# EAGLE design controller_board (EAGLE 7.6.0)
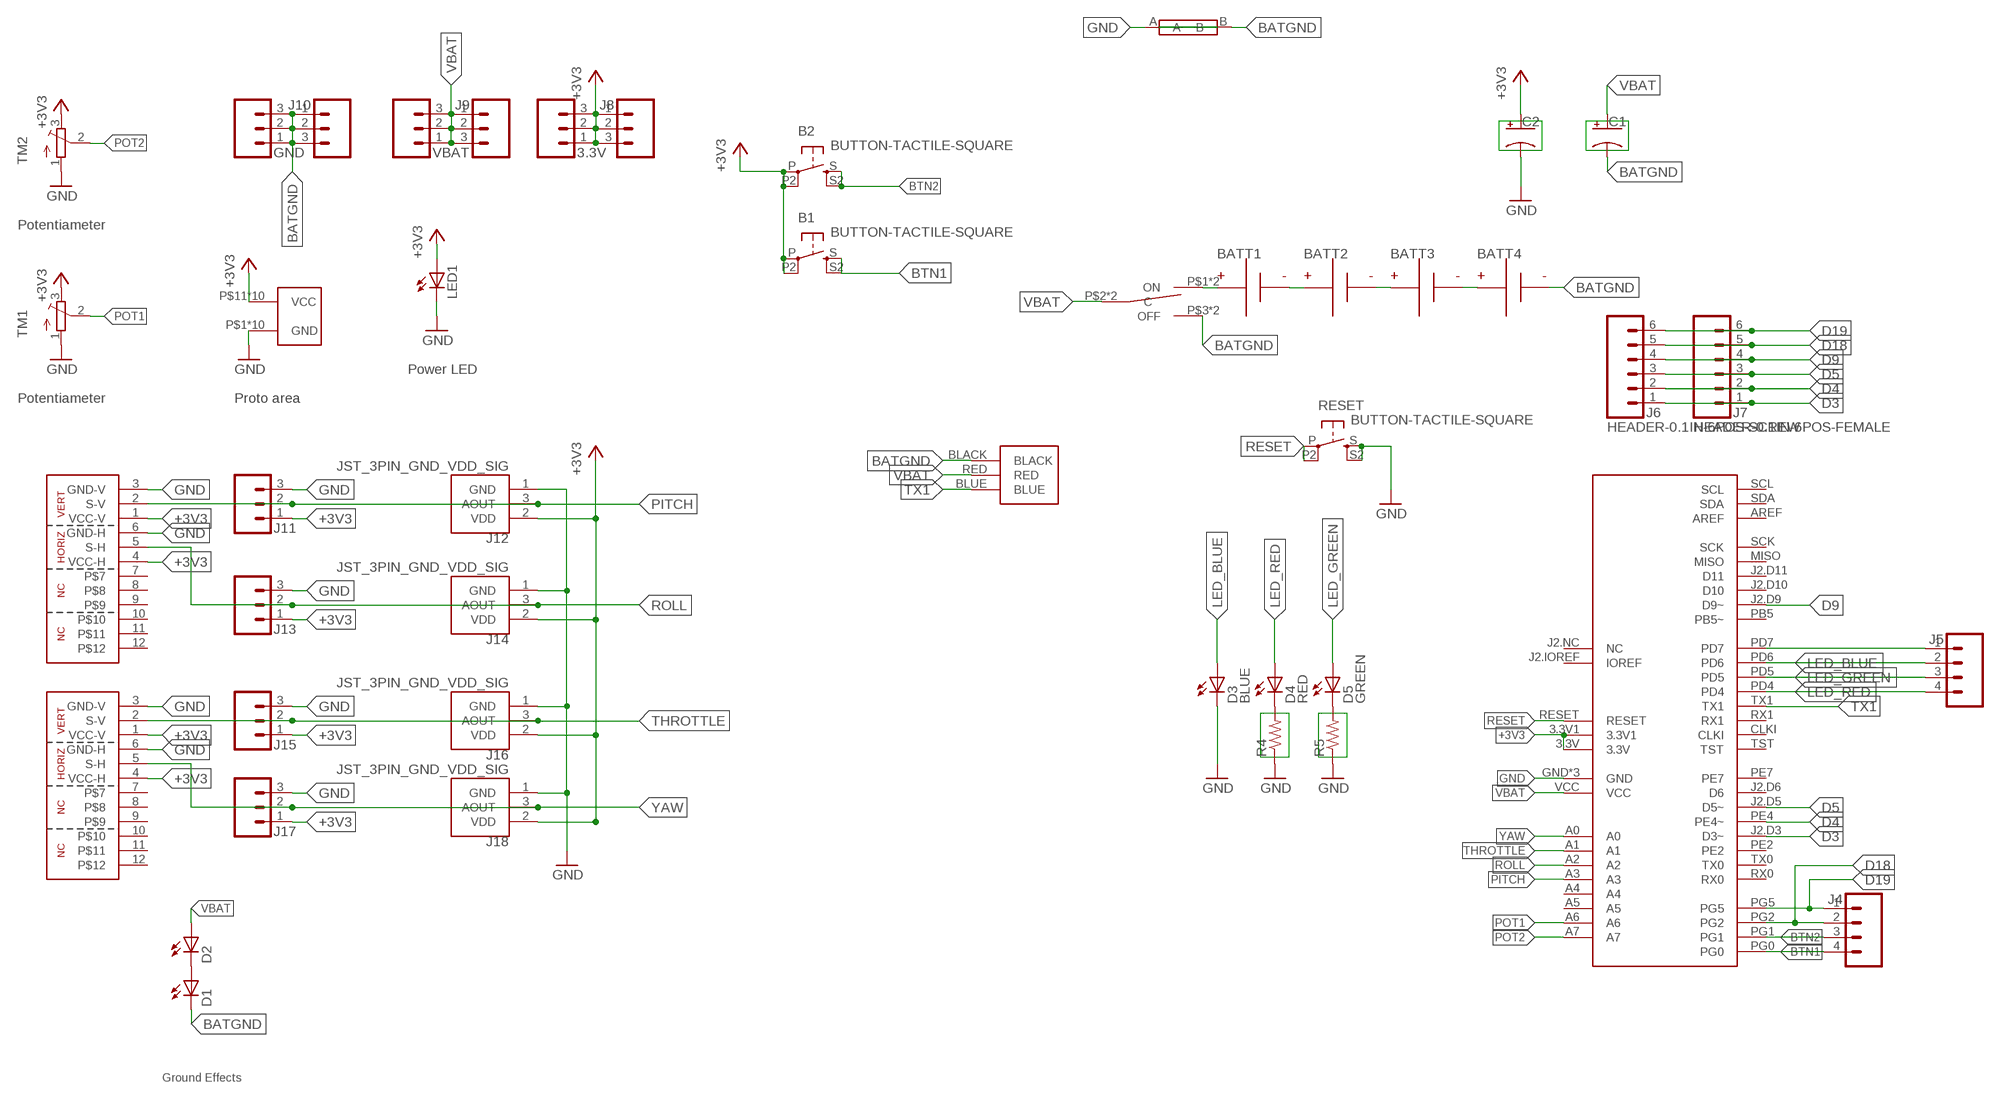
[diagram p0: schematic, sheet 1]

## Parts
3.3V  HEADER-0.1IN-3POS-SCREW  [SCREW-TERMINAL-1X3-2.54MM]
B1  BUTTON-TACTILE-SQUARE  [BUTTON-TACTILE-SQUARE-ADAFRUIT1010]
B2  BUTTON-TACTILE-SQUARE  [BUTTON-TACTILE-SQUARE-ADAFRUIT1010]
BATT1  BATTERY-AA-CLIP  [BATTERY-AA-BK-92]
BATT2  BATTERY-AA-CLIP  [BATTERY-AA-BK-92]
BATT3  BATTERY-AA-CLIP  [BATTERY-AA-BK-92]
BATT4  BATTERY-AA-CLIP  [BATTERY-AA-BK-92]
C1  RESOLVED-CAPACITOR-POL_TH-RADIAL_ALUMINUM_18MM  [CAPPRD750W80D1800H2200P]
C2  RESOLVED-CAPACITOR-POL_TH-RADIAL_ALUMINUM_6.3MM  [CAPPRD250W80D630H1220P]
D1  LED3MM  [LED3MM]
D2  LED3MM  [LED3MM]
D3  BLUE  LED3MM  [LED3MM]
D4  RED  LED3MM  [LED3MM]
D5  GREEN  LED3MM  [LED3MM]
F1  SHORT  [SHORT]
GND  HEADER-0.1IN-3POS-SCREW  [SCREW-TERMINAL-1X3-2.54MM]
J1  FRSKY-GIMBAL  [JST-13-PTH]
J2  FRSKY-GIMBAL  [JST-13-PTH]
J3  WIRE-HARNESS-SPARKFUN-9915  [WIRE-HARNESS-SPARKFUN-9915]
J4  HEADER-0.1IN-4POS-FEMALE  [HDRV4W63P254_4X1_1016X254H838_HS]
J5  HEADER-0.1IN-4POS-FEMALE  [HDRV4W63P254_4X1_1016X254H838_HS]
J6  HEADER-0.1IN-6POS-SCREW  [SCREW-TERMINAL-1X6-2.54MM]
J7  HEADER-0.1IN-6POS-FEMALE  [HDRV6W63P254_6X1_1524X254H838_HS]
J8  HEADER-0.1IN-3POS-FEMALE  [HDRV3W63P254_3X1_762X254H838_HS]
J9  HEADER-0.1IN-3POS-FEMALE  [HDRV3W63P254_3X1_762X254H838_HS]
J10  HEADER-0.1IN-3POS-FEMALE  [HDRV3W63P254_3X1_762X254H838_HS]
J11  HEADER-0.1IN-3POS-SCREW  [SCREW-TERMINAL-1X3-2.54MM]
J12  JST_3PIN_GND_VDD_SIG  [JST-3-PTH-REVERSE]
J13  HEADER-0.1IN-3POS-SCREW  [SCREW-TERMINAL-1X3-2.54MM]
J14  JST_3PIN_GND_VDD_SIG  [JST-3-PTH-REVERSE]
J15  HEADER-0.1IN-3POS-SCREW  [SCREW-TERMINAL-1X3-2.54MM]
J16  JST_3PIN_GND_VDD_SIG  [JST-3-PTH-REVERSE]
J17  HEADER-0.1IN-3POS-SCREW  [SCREW-TERMINAL-1X3-2.54MM]
J18  JST_3PIN_GND_VDD_SIG  [JST-3-PTH-REVERSE]
LED1  LED-5MM-RED  [LED5MM]
R4  RESOLVED-RESISTOR_TH-1/6W-CARBON  [RESAD770W45L370D210_HS]
R5  RESOLVED-RESISTOR_TH-1/6W-CARBON  [RESAD770W45L370D210_HS]
RESET  BUTTON-TACTILE-SQUARE  [BUTTON-TACTILE-SQUARE-ADAFRUIT1010]
S1  POWER-SWITCH-MFS201N-9-Z  [POWER-SWITCH-MFS201N-9-Z]
TM1  TRIMPOT3386  [TRIM-3386]
TM2  TRIMPOT3386  [TRIM-3386]
U$3  PROTO-AREA-10X10  [PROTO-AREA-10X10]
U$4  ATMEGA128RFA1-BOB  [ATMEGA128RFA1]
VBAT  HEADER-0.1IN-3POS-SCREW  [SCREW-TERMINAL-1X3-2.54MM]

## Nets
+3V3: 3.3V.1 3.3V.2 3.3V.3 B1.P B1.P2(P1) B2.P B2.P2(P1) C2.1(+) J1.1(VCC-V) J1.4(VCC-H) J2.1(VCC-V) J2.4(VCC-H) J8.1 J8.2 J8.3 J11.1 J12.2(VDD) J13.1 J14.2(VDD) J15.1 J16.2(VDD) J17.1 J18.2(VDD) LED1.A TM1.3(E) TM2.3(E) U$3.P$11(VCC) U$3.P$12(VCC) U$3.P$13(VCC) U$3.P$14(VCC) U$3.P$15(VCC) U$3.P$16(VCC) U$3.P$17(VCC) U$3.P$18(VCC) U$3.P$19(VCC) U$3.P$20(VCC) U$4.3.3V U$4.3.3V1
BATGND [HIGH-I]: BATT4.N1(N) BATT4.N2(N) C1.2(-) D1.K(C) F1.B GND.1 GND.3 J3.BLACK J10.1 J10.2 J10.3 S1.P$3(OFF) S1.P$6(OFF)
BTN1: B1.S B1.S2(S1) J4.4 U$4.PG0
BTN2: B2.S B2.S2(S1) J4.3 U$4.PG1
D3: J6.1 J7.1 U$4.J2.D3(D3~)
D4: J6.2 J7.2 U$4.PE4(PE4~)
D5: J6.3 J7.3 U$4.J2.D5(D5~)
D9: J6.4 J7.4 U$4.J2.D9(D9~)
D18: J4.2 J6.5 J7.5 U$4.PG2
D19: J4.1 J6.6 J7.6 U$4.PG5
GND: C2.2(-) D3.K(C) F1.A J1.3(GND-V) J1.6(GND-H) J2.3(GND-V) J2.6(GND-H) J11.3 J12.1(GND) J13.3 J14.1(GND) J15.3 J16.1(GND) J17.3 J18.1(GND) LED1.K(C) R4.1 R5.1 RESET.S RESET.S2(S1) TM1.1(A) TM2.1(A) U$3.P$1(GND) U$3.P$2(GND) U$3.P$3(GND) U$3.P$4(GND) U$3.P$5(GND) U$3.P$6(GND) U$3.P$7(GND) U$3.P$8(GND) U$3.P$9(GND) U$3.P$10(GND) U$4.GND U$4.GND1(GND) U$4.GND2(GND)
LED_BLUE: D3.A J5.2 U$4.PD6
LED_GREEN: D5.A J5.3 U$4.PD5
LED_RED: D4.A J5.4 U$4.PD4
N$1 [HIGH-I]: BATT1.N1(N) BATT1.N2(N) BATT2.P1(P) BATT2.P2(P)
N$2 [HIGH-I]: BATT2.N1(N) BATT2.N2(N) BATT3.P1(P) BATT3.P2(P)
N$3 [HIGH-I]: BATT3.N1(N) BATT3.N2(N) BATT4.P1(P) BATT4.P2(P)
N$4: D4.K(C) R4.2
N$5 [HIGH-I]: BATT1.P1(P) BATT1.P2(P) S1.P$1(ON) S1.P$4(ON)
N$6: D5.K(C) R5.2
N$9: J5.1 U$4.PD7
N$13: D1.A D2.K(C)
PITCH: J1.2(S-V) J11.2 J12.3(AOUT) U$4.A3
POT1: TM1.2(S) U$4.A6
POT2: TM2.2(S) U$4.A7
RESET: RESET.P RESET.P2(P1) U$4.RESET
ROLL: J1.5(S-H) J13.2 J14.3(AOUT) U$4.A2
THROTTLE: J2.2(S-V) J15.2 J16.3(AOUT) U$4.A1
TX1: J3.BLUE U$4.TX1
VBAT [HIGH-I]: C1.1(+) D2.A J3.RED J9.1 J9.2 J9.3 S1.P$2(C) S1.P$5(C) U$4.VCC VBAT.1 VBAT.2 VBAT.3
YAW: J2.5(S-H) J17.2 J18.3(AOUT) U$4.A0
Unconnected: GND.2 J1.7 J1.8 J1.9 J1.10 J1.11 J1.12 J2.7 J2.8 J2.9 J2.10 J2.11 J2.12 U$4.A4 U$4.A5 U$4.AREF U$4.CLKI U$4.J2.D6(D6) U$4.J2.D10(D10) U$4.J2.D11(D11) U$4.J2.IOREF(IOREF) U$4.J2.NC(NC) U$4.MISO U$4.PB5(PB5~) U$4.PE2 U$4.PE7 U$4.RX0 U$4.RX1 U$4.SCK U$4.SCL U$4.SDA U$4.TST U$4.TX0

## Notes on the sheet
- Potentiameter
- Power LED
- Potentiameter | Proto area
- Ground Effects

## Library data of the parts
3.3V GND VBAT = Components:HEADER-0.1IN-3POS: 3 pin single inline pin header, socket, or connector; DIST: digikey; DISTPN: ED10562-ND
B1 B2 RESET = Controller:BUTTON-TACTILE; DIST: ADAFRUIT; DISTPN: 1010
BATT1-BATT4 = Components:BATTERY; DIST: Digikey; DISTPN: BK-92-ND; QTY: 2; ROUGH_HEIGHT: 16
C1 = KoalaBuild:RESOLVED-CAPACITOR-POL_: Polarized capacitor; DIST: Digikey; DISTPN: P5158-ND
C2 = KoalaBuild:RESOLVED-CAPACITOR-POL_: Polarized capacitor; DIST: Digikey; DISTPN: P5152-ND
D1-D3 = Components:LED: LED OSRAM: - CHIPLED LG R971, LG N971, LY N971, LG Q971, LY Q971, LO R971, LY R971 LH N974, LH R974 LS Q976, LO Q976, LY Q976 LO Q996 - Hyper CHIPLED LW Q18S LB Q993, LB Q99A, LB R99A - SideLED LS A670, LO A670, LY A670, LG A670, LP A670 LB A673, LV A673, LT A673, LW A673 LH A674 LY A675 LS A676, LA A676, LO A676, LY A676, LW A676 LS A679, LY A679, LG A679 - Hyper Micro SIDELED® LS Y876, LA Y876, LO Y876, LY Y876 LT Y87S - SmartLED LW L88C, LW L88S LB L89C, LB L89S, LG L890 LS L89K, LO L89K, LY L89K LS L896, LA L896, LO L896, LY L896 - TOPLED LS T670, LO T670, LY T670, LG T670, LP T670 LSG T670, LSP T670, LSY T670, LOP T670, LYG T670 LG T671, LOG T671, LSG T671 LB T673, LV T673, LT T673, LW T673 LH T674 LS T676, LA T676, LO T676, LY T676, LB T676, LH T676, LSB T676, LW T676 LB T67C, LV T67C, LT T67C, LS T67K, LO T67K, LY T67K, LW E67C LS E67B, LA E67B, LO E67B, LY E67B, LB E67C, LV E67C, LT E67C LW T67C LS T679, LY T679, LG T679 LS T770, LO T770, LY T770, LG T770, LP T770 LB T773, LV T773, LT T773, LW T773 LH T774 LS E675, LA E675, LY E675, LS T675 LS T776, LA T776, LO T776, LY T776, LB T776 LHGB T686 LT T68C, LB T68C - Hyper Mini TOPLED® LB M676 - Mini TOPLED Santana® LG M470 LS M47K, LO M47K, LY M47K Source: http://www.osram.convergy.de/; DIST: Adafruit; DISTPN: 780
D4 = Components:LED: LED OSRAM: - CHIPLED LG R971, LG N971, LY N971, LG Q971, LY Q971, LO R971, LY R971 LH N974, LH R974 LS Q976, LO Q976, LY Q976 LO Q996 - Hyper CHIPLED LW Q18S LB Q993, LB Q99A, LB R99A - SideLED LS A670, LO A670, LY A670, LG A670, LP A670 LB A673, LV A673, LT A673, LW A673 LH A674 LY A675 LS A676, LA A676, LO A676, LY A676, LW A676 LS A679, LY A679, LG A679 - Hyper Micro SIDELED® LS Y876, LA Y876, LO Y876, LY Y876 LT Y87S - SmartLED LW L88C, LW L88S LB L89C, LB L89S, LG L890 LS L89K, LO L89K, LY L89K LS L896, LA L896, LO L896, LY L896 - TOPLED LS T670, LO T670, LY T670, LG T670, LP T670 LSG T670, LSP T670, LSY T670, LOP T670, LYG T670 LG T671, LOG T671, LSG T671 LB T673, LV T673, LT T673, LW T673 LH T674 LS T676, LA T676, LO T676, LY T676, LB T676, LH T676, LSB T676, LW T676 LB T67C, LV T67C, LT T67C, LS T67K, LO T67K, LY T67K, LW E67C LS E67B, LA E67B, LO E67B, LY E67B, LB E67C, LV E67C, LT E67C LW T67C LS T679, LY T679, LG T679 LS T770, LO T770, LY T770, LG T770, LP T770 LB T773, LV T773, LT T773, LW T773 LH T774 LS E675, LA E675, LY E675, LS T675 LS T776, LA T776, LO T776, LY T776, LB T776 LHGB T686 LT T68C, LB T68C - Hyper Mini TOPLED® LB M676 - Mini TOPLED Santana® LG M470 LS M47K, LO M47K, LY M47K Source: http://www.osram.convergy.de/; DIST: Adafruit; DISTPN: 777
D5 = Components:LED: LED OSRAM: - CHIPLED LG R971, LG N971, LY N971, LG Q971, LY Q971, LO R971, LY R971 LH N974, LH R974 LS Q976, LO Q976, LY Q976 LO Q996 - Hyper CHIPLED LW Q18S LB Q993, LB Q99A, LB R99A - SideLED LS A670, LO A670, LY A670, LG A670, LP A670 LB A673, LV A673, LT A673, LW A673 LH A674 LY A675 LS A676, LA A676, LO A676, LY A676, LW A676 LS A679, LY A679, LG A679 - Hyper Micro SIDELED® LS Y876, LA Y876, LO Y876, LY Y876 LT Y87S - SmartLED LW L88C, LW L88S LB L89C, LB L89S, LG L890 LS L89K, LO L89K, LY L89K LS L896, LA L896, LO L896, LY L896 - TOPLED LS T670, LO T670, LY T670, LG T670, LP T670 LSG T670, LSP T670, LSY T670, LOP T670, LYG T670 LG T671, LOG T671, LSG T671 LB T673, LV T673, LT T673, LW T673 LH T674 LS T676, LA T676, LO T676, LY T676, LB T676, LH T676, LSB T676, LW T676 LB T67C, LV T67C, LT T67C, LS T67K, LO T67K, LY T67K, LW E67C LS E67B, LA E67B, LO E67B, LY E67B, LB E67C, LV E67C, LT E67C LW T67C LS T679, LY T679, LG T679 LS T770, LO T770, LY T770, LG T770, LP T770 LB T773, LV T773, LT T773, LW T773 LH T774 LS E675, LA E675, LY E675, LS T675 LS T776, LA T776, LO T776, LY T776, LB T776 LHGB T686 LT T68C, LB T68C - Hyper Mini TOPLED® LB M676 - Mini TOPLED Santana® LG M470 LS M47K, LO M47K, LY M47K Source: http://www.osram.convergy.de/; DIST: Adafruit; DISTPN: 779
F1 = RemotePartsB:SHORT
J1 = RemotePartsB:FRSKY-GIMBAL; CH1: PITCH; CH2: ROLL; DIST: Digikey; DISTPN: A100106-ND
J2 = RemotePartsB:FRSKY-GIMBAL; CH1: THR; CH2: YAW; DIST: Digikey; DISTPN: A100106-ND
J3 = RemotePartsB:WIRE-HARNESS-SPARKFUN-9915; DIST: Sparkfun; DISTPN: 9915
J4 J5 = Components:HEADER-0.1IN-4POS: 4 pin single inline pin header, socket, or connector; DIST: Digikey; DISTPN: S7002-ND
J6 = Components:HEADER-0.1IN-6POS: 6 pin single inline pin header, socket, or connector; DIST: Digikey; DISTPN: ED10565-ND; PIN1: D3; PIN2: D4; PIN3: D5; PIN4: D9; PIN5: D18; PIN6: D19
J7 = Components:HEADER-0.1IN-6POS: 6 pin single inline pin header, socket, or connector; DIST: MISSING; DISTPN: MISSING
J8-J10 = Components:HEADER-0.1IN-3POS: 3 pin single inline pin header, socket, or connector; DIST: Digikey; DISTPN: S7002-ND; PIN1: 1; PIN2: 2; PIN3: 3
J11 J13 J15 J17 = Components:HEADER-0.1IN-3POS: 3 pin single inline pin header, socket, or connector; DIST: digikey; DISTPN: ED10562-ND; PIN1: +; PIN2: A; PIN3: -
J12 J14 J16 J18 = RemotePartsB:JST_3PIN_GND_VDD_SIG; DIST: DIGIKEY; DISTPN: A100097-ND
LED1 = Components:LED: LED OSRAM: - CHIPLED LG R971, LG N971, LY N971, LG Q971, LY Q971, LO R971, LY R971 LH N974, LH R974 LS Q976, LO Q976, LY Q976 LO Q996 - Hyper CHIPLED LW Q18S LB Q993, LB Q99A, LB R99A - SideLED LS A670, LO A670, LY A670, LG A670, LP A670 LB A673, LV A673, LT A673, LW A673 LH A674 LY A675 LS A676, LA A676, LO A676, LY A676, LW A676 LS A679, LY A679, LG A679 - Hyper Micro SIDELED® LS Y876, LA Y876, LO Y876, LY Y876 LT Y87S - SmartLED LW L88C, LW L88S LB L89C, LB L89S, LG L890 LS L89K, LO L89K, LY L89K LS L896, LA L896, LO L896, LY L896 - TOPLED LS T670, LO T670, LY T670, LG T670, LP T670 LSG T670, LSP T670, LSY T670, LOP T670, LYG T670 LG T671, LOG T671, LSG T671 LB T673, LV T673, LT T673, LW T673 LH T674 LS T676, LA T676, LO T676, LY T676, LB T676, LH T676, LSB T676, LW T676 LB T67C, LV T67C, LT T67C, LS T67K, LO T67K, LY T67K, LW E67C LS E67B, LA E67B, LO E67B, LY E67B, LB E67C, LV E67C, LT E67C LW T67C LS T679, LY T679, LG T679 LS T770, LO T770, LY T770, LG T770, LP T770 LB T773, LV T773, LT T773, LW T773 LH T774 LS E675, LA E675, LY E675, LS T675 LS T776, LA T776, LO T776, LY T776, LB T776 LHGB T686 LT T68C, LB T68C - Hyper Mini TOPLED® LB M676 - Mini TOPLED Santana® LG M470 LS M47K, LO M47K, LY M47K Source: http://www.osram.convergy.de/; DIST: Adafruit; DISTPN: 679; ROUGH_HEIGHT: 13
R4 R5 = KoalaBuild:RESOLVED-RESISTOR_: Resistor; DIST: Digikey; DISTPN: 68EBK-ND
S1 = RemotePartsB:POWER-SWITCH-MFS201N-9-Z; DIST: Digikey; DISTPN: 563-1565-ND
TM1 TM2 = RemotePartsB:TRIMPOT: SMT trimmer potentiometer part number TC33X http://www.ladyada.net/library/eagle; DIST: Adafruit; DISTPN: 356
U$3 = Components:PROTO-AREA; DIST: Gadgetron; DISTPN: proto-area-10x10; ROUGH_HEIGHT: 15
U$4 = BOBs:ATMEGA128RFA1; DIST: Adafruit; DISTPN: 85

## Net classes
1 HIGH-I: width 1.5 mm

## Board
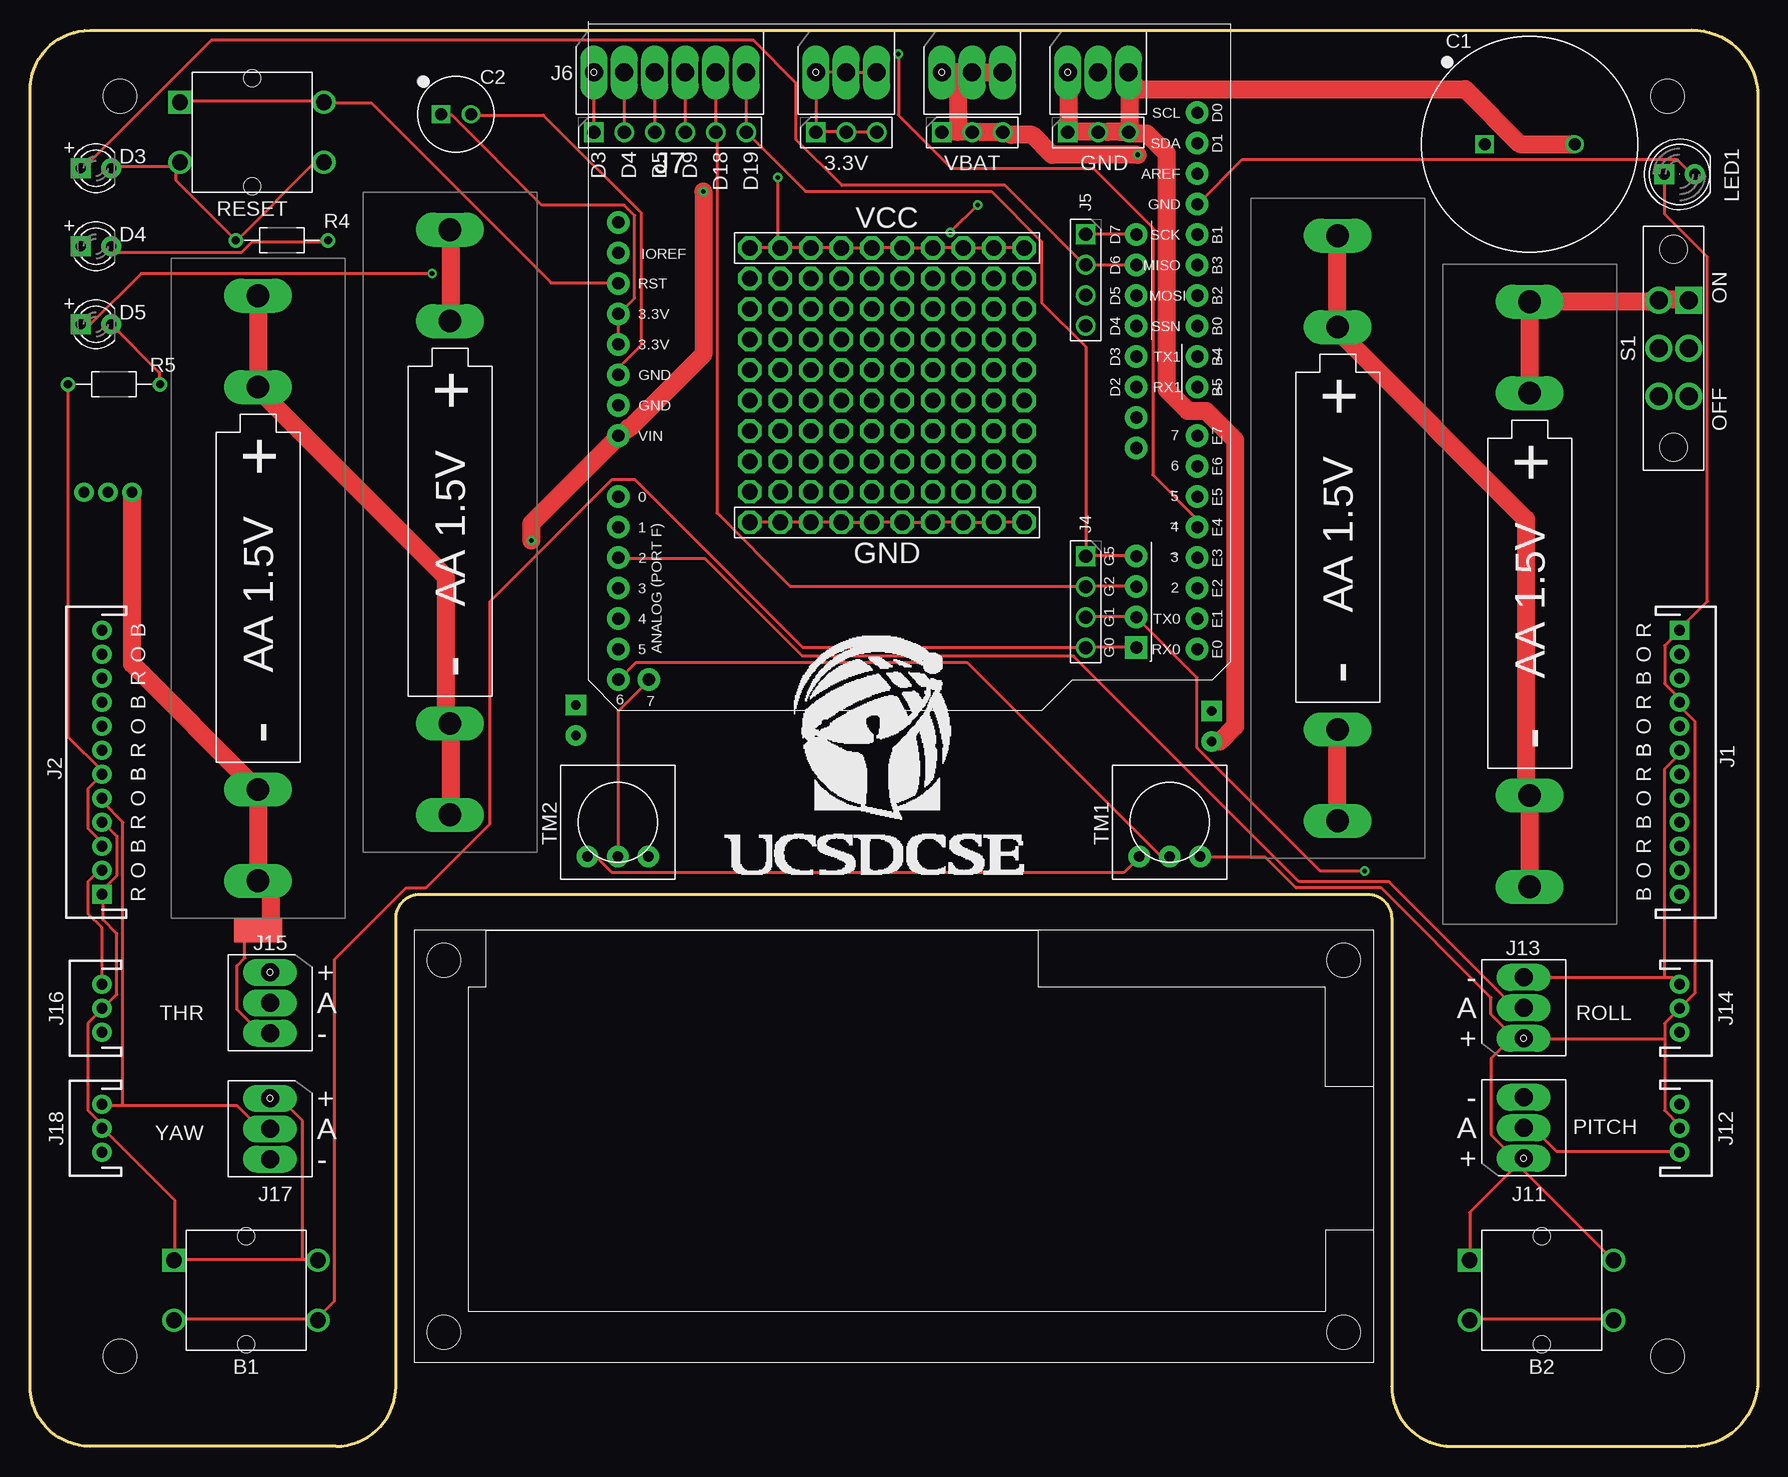
[diagram p1: board, top side]
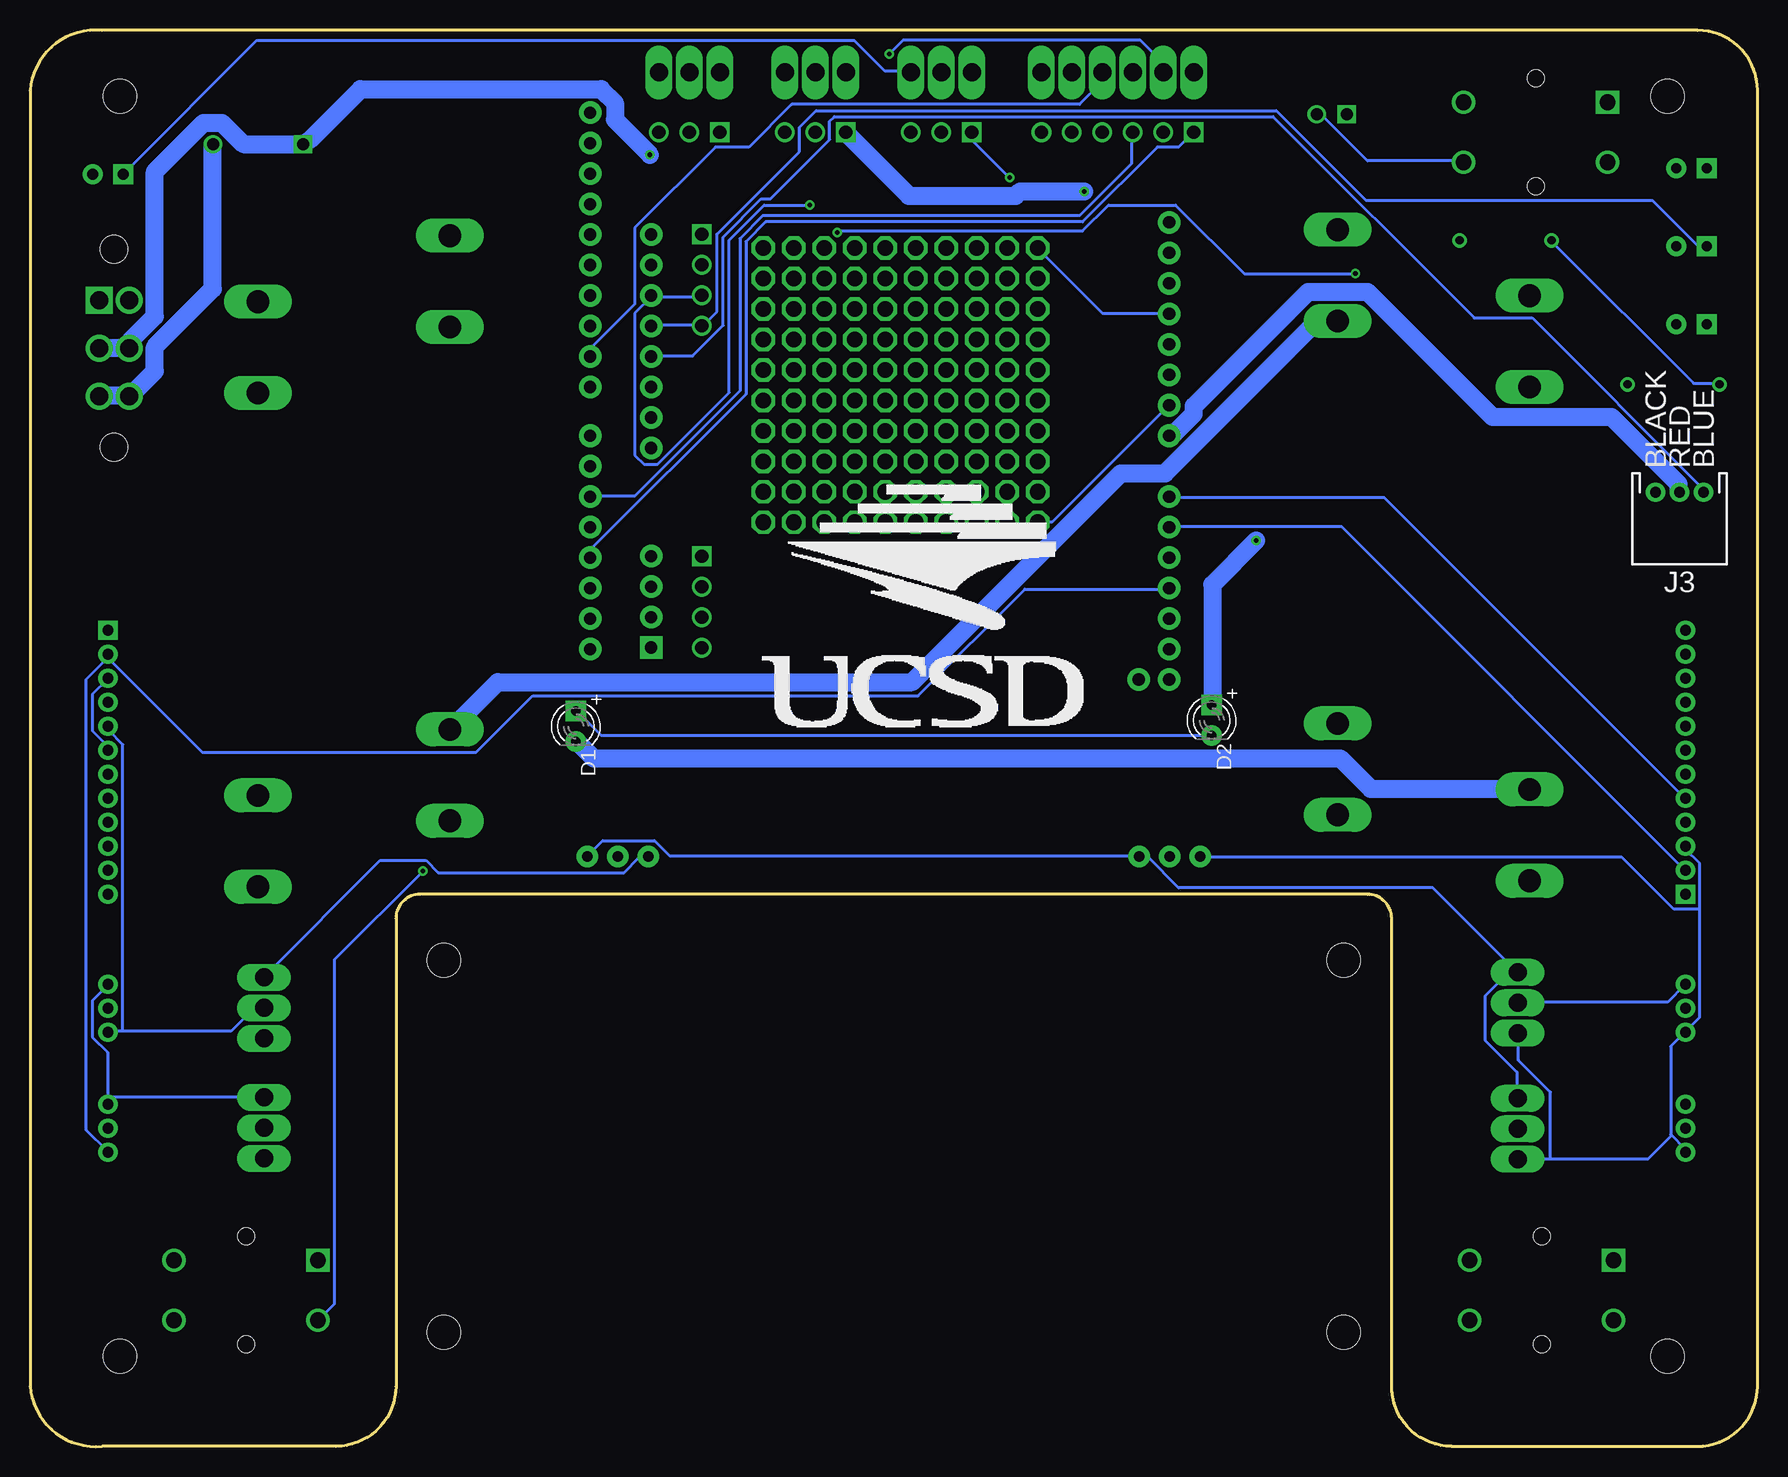
[diagram p2: board, bottom side, seen from below]

Size 144 x 118.05 mm. Coordinates in mm from the lower left corner, seen from the top.
Outline: 30.5,5.02 30.5,44.02 arc-90 32.5,46.02 111.5,46.02 arc-90 113.5,44.02 113.5,5.02 arc90 118.5,0.02 138,0.02 arc90 144,5.02 144,113.02 arc90 138,118.02 5,118.02 arc90 0,113.02 0,5.02 arc90 5,0.02 25.5,0.02 arc90 30.5,5.02
Copper layers (1*16): Top 0.035559375mm / dielectric 1.501140625mm / Bottom 0.035559375mm
Design rules "4pcb-33board *": minimum track width 10mil, minimum drill 15mil, track to track 10mil, track to pad 10mil, pad to pad 10mil, via to via 10mil, smd to smd 6mil, copper to edge 10mil, drill to drill 10mil, minimum pad ring 10mil, minimum via ring 8mil, stop-mask expansion 4mil, vias tented up to drill 0mil, thermal gap 10mil

### Footprints (pad centres in the part's own frame; a part is rotated, then mirrored left to right if it is on the bottom)
SCREW-TERMINAL-1X3-2.54MM = drill 1.5 pad 1.778 long: 1 0,0; 2 2.54,0; 3 5.08,0
BUTTON-TACTILE-SQUARE-ADAFRUIT1010 = drill 1.3 square: P -6,2.5 | drill 1.3: P2 6,2.5; S -6,-2.5; S2 6,-2.5 | hole 1.4: 0,4.5; 0,-4.5
BATTERY-AA-BK-92 = drill 1.9 long: N1 16.765,0; N2 24.385,0; P1 -24.385,0; P2 -16.765,0
CAPPRD750W80D1800H2200P = drill 1 pad 1.5 square: 1 -3.75,0 | drill 1 pad 1.5: 2 3.75,0
CAPPRD250W80D630H1220P = drill 1 pad 1.5 square: 1 -1.25,0 | drill 1 pad 1.5: 2 1.25,0
LED3MM = drill 0.813 pad 1.676 square: A -1.27,0 | drill 0.813 pad 1.676: K 1.27,0
SHORT = smd 2 x 2: A -1,0; B 1,0
JST-13-PTH = drill 0.9 pad 1.6 square: 1 -2,0 | drill 0.9 pad 1.6: 2 0,0; 3 2,0; 4 4,0; 5 6,0; 6 8,0; 7 10,0; 8 12,0; 9 14,0; 10 16,0; 11 18,0; 12 20,0
WIRE-HARNESS-SPARKFUN-9915 = drill 0.9 pad 1.6: BLACK 2,0; BLUE -2,0; RED 0,0
HDRV4W63P254_4X1_1016X254H838_HS = drill 1.1 pad 1.65 square: 1 0,0 | drill 1.1 pad 1.65: 2 2.54,0; 3 5.08,0; 4 7.62,0
SCREW-TERMINAL-1X6-2.54MM = drill 1.5 pad 1.778 long: 1 0,0; 2 2.54,0; 3 5.08,0; 4 7.62,0; 5 10.16,0; 6 12.7,0
HDRV6W63P254_6X1_1524X254H838_HS = drill 1.1 pad 1.65 square: 1 0,0 | drill 1.1 pad 1.65: 2 2.54,0; 3 5.08,0; 4 7.62,0; 5 10.16,0; 6 12.7,0
HDRV3W63P254_3X1_762X254H838_HS = drill 1.1 pad 1.65 square: 1 0,0 | drill 1.1 pad 1.65: 2 2.54,0; 3 5.08,0
JST-3-PTH-REVERSE = drill 0.9 pad 1.6: 1 -2,0; 2 0,0; 3 2,0
SPARKFUN_LCD_33 = hole 2.8: 77.5,2.5; 77.5,33.5; 2.5,2.5; 2.5,33.5
LED5MM = drill 0.9 pad 1.676 square: A -1.27,0 | drill 0.9 pad 1.676: K 1.27,0
CONTROLLER_OUTLINE = hole 2.8: -64.5,-52.5; 64.5,-52.5; 64.5,52.5; -64.5,52.5
RESAD770W45L370D210_HS = drill 0.7 pad 1.1: 1 -3.85,0; 2 3.85,0
POWER-SWITCH-MFS201N-9-Z = drill 1.5 square: P$1 -4,1.25 | drill 1.5: P$2 0,1.25; P$3 4,1.25; P$4 -4,-1.25; P$5 0,-1.25; P$6 4,-1.25 | hole 2.3: -8.25,0; 8.25,0
TRIM-3386 = drill 0.9 pad 1.778: 1 -2.54,-2.857; 2 0,-2.857; 3 2.54,-2.857
PROTO-AREA-10X10 = drill 1.3 octagon: P$1 0,0; P$2 2.54,0; P$3 5.08,0; P$4 7.62,0; P$5 10.16,0; P$6 12.7,0; P$7 15.24,0; P$8 17.78,0; P$9 20.32,0; P$10 22.86,0; P$11 0,22.86; P$12 2.54,22.86; P$13 5.08,22.86; P$14 7.62,22.86; P$15 10.16,22.86; P$16 12.7,22.86; P$17 15.24,22.86; P$18 17.78,22.86; P$19 20.32,22.86; P$20 22.86,22.86; P$21 0,2.54; P$22 2.54,2.54; P$23 5.08,2.54; P$24 7.62,2.54; P$25 10.16,2.54; P$26 12.7,2.54; P$27 15.24,2.54; P$28 17.78,2.54; P$29 20.32,2.54; P$30 22.86,2.54; P$31 22.86,5.08; P$32 20.32,5.08; P$33 17.78,5.08; P$34 15.24,5.08; P$35 12.7,5.08; P$36 10.16,5.08; P$37 7.62,5.08; P$38 5.08,5.08; P$39 2.54,5.08; P$40 0,5.08; P$41 0,7.62; P$42 2.54,7.62; P$43 5.08,7.62; P$44 7.62,7.62; P$45 10.16,7.62; P$46 12.7,7.62; P$47 15.24,7.62; P$48 17.78,7.62; P$49 20.32,7.62; P$50 22.86,7.62; P$51 22.86,10.16; P$52 20.32,10.16; P$53 17.78,10.16; P$54 15.24,10.16; P$55 12.7,10.16; P$56 10.16,10.16; P$57 7.62,10.16; P$58 5.08,10.16; P$59 2.54,10.16; P$60 0,10.16; P$61 0,12.7; P$62 2.54,12.7; P$63 5.08,12.7; P$64 7.62,12.7; P$65 10.16,12.7; P$66 12.7,12.7; P$67 15.24,12.7; P$68 17.78,12.7; P$69 20.32,12.7; P$70 22.86,12.7; P$71 22.86,15.24; P$72 20.32,15.24; P$73 17.78,15.24; P$74 15.24,15.24; P$75 12.7,15.24; P$76 10.16,15.24; P$77 7.62,15.24; P$78 5.08,15.24; P$79 2.54,15.24; P$80 0,15.24; P$81 0,17.78; P$82 2.54,17.78; P$83 5.08,17.78; P$84 7.62,17.78; P$85 10.16,17.78; P$86 12.7,17.78; P$87 15.24,17.78; P$88 17.78,17.78; P$89 20.32,17.78; P$90 22.86,17.78; P$91 22.86,20.32; P$92 20.32,20.32; P$93 17.78,20.32; P$94 15.24,20.32; P$95 12.7,20.32; P$96 10.16,20.32; P$97 7.62,20.32; P$98 5.08,20.32; P$99 2.54,20.32; P$100 0,20.32
ATMEGA128RFA1 = drill 1.016 pad 1.88: 3.3V 26.67,2.54; 3.3V1 24.13,2.54; A0 39.37,2.54; A1 41.91,2.54; A2 44.45,2.54; A3 46.99,2.54; A4 49.53,2.54; A5 52.07,2.54; A6 54.61,2.54; A7 54.61,5.08; AREF 12.446,50.8; CLKI 32.766,45.72; GND 29.21,2.54; GND1 31.75,2.54; GND2 14.986,50.8; J2.D3 44.45,50.8; J2.D5 39.37,50.8; J2.D6 36.83,50.8; J2.D9 27.686,50.8; J2.D10 25.146,50.8; J2.D11 22.606,50.8; J2.IOREF 19.05,2.54; J2.NC 16.51,2.54; MISO 20.066,50.8; PB5 30.226,50.8; PD4 25.146,45.72; PD5 22.606,45.72; PD6 20.066,45.72; PD7 17.526,45.72; PE2 46.99,50.8; PE4 41.91,50.8; PE7 34.29,50.8; PG1 49.403,45.72; PG2 46.863,45.72; PG5 44.323,45.72; RESET 21.59,2.54; RX0 52.07,50.8; RX1 30.226,45.72; SCK 17.526,50.8; SCL 7.366,50.8; SDA 9.906,50.8; TST 35.306,45.72; TX0 49.53,50.8; TX1 27.686,45.72; VCC 34.29,2.54 | drill 1.016 pad 1.88 square: PG0 51.943,45.72

### Placement (x,y rotation side)
3.3V  65.5,114.52 0 top
B1  18,13.02 0 top
B2  126,13.02 0 top
BATT1  125,71.02 270 top
BATT2  109,76.52 270 top
BATT3  35,77.02 270 top
BATT4  19,71.52 270 top
C1  125,108.52 0 top
C2  35.5,111.02 0 top
D1  98.5,60.02 270 bottom
D2  45.5,60.52 270 bottom
D3  5.5,106.52 0 top
D4  5.5,100.02 0 top
D5  5.5,93.52 0 top
F1  19,43.02 0 top
GND  86.5,114.52 0 top
J1  137.5,66.02 270 top
J2  6,48.02 90 top
J3  6.5,79.52 180 bottom
J4  88,74.19 270 top
J5  88,101.02 270 top
J6  47,114.52 0 top
J7  47,109.52 0 top
J8  65.5,109.52 0 top
J9  76,109.52 0 top
J10  86.5,109.52 0 top
J11  124.5,24.02 90 top
J12  137.5,26.52 270 top
J13  124.5,34.02 90 top
J14  137.5,36.52 270 top
J15  20,39.52 270 top
J16  6,36.52 90 top
J17  20,29.02 270 top
J18  6,26.52 90 top
LCD  [SPARKFUN_LCD_33]  32,7.02 0 top
LED1  137.5,106.02 0 top
OUTLINE  [CONTROLLER_OUTLINE]  72,60.02 0 top
R4  21,100.52 0 top
R5  7,88.52 0 top
RESET  18.5,109.52 0 top
S1  137,91.52 270 top
TM1  95,52.02 0 top
TM2  49,52.02 0 top
U$1  [CSE_LOGO_30X20MM]  55.5,67.52 0 top
U$2  [UCSD_LOGO_COMBINED_26X20MM]  83,80.02 0 bottom
U$3  60,77.02 0 top
U$4  46.5,118.52 270 top
VBAT  76,114.52 0 top

### Tracks (layer width: path | path; a pad name or v marks a point on that pad's centre or on a via)
+3V3  (via drill 0.38)
  Top 0.254: 22.72,15.57 23.99,15.57 B1.P2 | 22.72,15.57 12.06,15.57 B1.P 12.06,15.7 12.06,20.53 6.09,26.49 J18.2 5.96,26.62 5.96,26.88 4.82,28.02 4.82,35.26 5.96,36.4 J16.2 6.09,36.53 7.23,37.67 7.23,42.75 6.09,43.89 6.09,45.93 J2.1 6.09,46.05 6.09,46.43 7.23,47.58 7.23,50.88 6.09,52.02 J2.4 | 22.72,15.57 22.72,27.13 20.95,28.91 20.06,28.91 J17.1 | C2.1 34.28,110.95 35.17,110.95 42.66,103.46 49.52,103.46 50.41,102.57 50.41,95.71 49.14,94.44 U$4.3.3V1 49.01,94.31 49.01,91.9 U$4.3.3V | J8.3 70.48,109.55 68.06,109.55 J8.2 67.94,109.55 65.52,109.55 J8.1 65.52,109.68 65.52,114.38 3.3V.1 65.52,114.51 67.94,114.51 3.3V.2 68.06,114.51 70.48,114.51 3.3V.3 | U$3.P$20 82.8,99.9 80.38,99.9 U$3.P$19 80.25,99.9 77.84,99.9 U$3.P$18 77.72,99.9 75.3,99.9 U$3.P$17 75.17,99.9 72.76,99.9 U$3.P$16 72.64,99.9 70.22,99.9 U$3.P$15 70.09,99.9 67.68,99.9 U$3.P$14 67.56,99.9 65.14,99.9 U$3.P$13 65.02,99.9 62.6,99.9 U$3.P$12 | 62.35,99.9 62.48,99.9 U$3.P$12 | 62.35,99.9 60.06,99.9 U$3.P$11 | 62.35,99.9 v62.35,105.74 | 62.35,99.9 U$3.P$12 | LED1.A 136.26,106 136.26,102.69 139.82,99.14 139.82,70.44 137.53,68.15 J1.1 137.41,67.9 136.26,66.75 136.26,63.58 137.41,62.44 137.41,62.05 J1.4 137.53,61.93 137.53,61.67 138.8,60.4 138.8,37.8 137.53,36.53 J14.2 137.41,36.4 136.26,35.26 136.26,33.99 | B2.P 120.01,15.57 120.01,19.51 124.45,23.95 J11.1 | B2.P2 131.94,15.57 124.07,23.45 J11.1 | 136.26,33.99 136.26,28.02 137.41,26.88 137.41,26.62 J12.2 | TM1.3 97.65,49.1 102.99,49.1 105.53,46.56 112.64,46.56 121.78,37.42 121.78,36.02 123.69,34.11 124.45,34.11 J13.1 | 136.26,33.99 124.58,33.99 J13.1
  Top 0.254: J11.1 124.07,23.7 121.78,25.99 121.78,32.34 123.56,34.11 J13.1
  Bottom 0.254: J17.1 20.06,29.03 20.06,31.19 22.72,33.86 22.72,37.54 20.44,39.83 J15.1 20.06,39.58 27.04,46.56 48.25,46.56 50.79,49.1 51.43,49.1 TM2.3 51.55,49.23 90.67,49.23 91.94,50.5 96.26,50.5 97.53,49.23 TM1.3 | v62.35,105.74 65.4,108.79 65.4,109.43 J8.1 | U$4.3.3V1 49.14,94.44 54.6,94.44 59.94,99.77 U$3.P$11 | 3.3V.3 70.6,114.63 72.76,114.63 75.3,117.17 125.09,117.17 136.13,106.12 LED1.A
BATGND
  Top 1.5: F1.B 20.06,43.13 20.06,46.05 19.04,47.07 BATT4.N2 19.04,47.83 19.04,54.05 BATT4.N1 18.91,54.82 8.5,65.23 J3.BLACK | GND.1 86.61,114.51 86.61,110.19 J10.1 86.61,109.55 89.02,109.55 J10.2 89.78,109.55 90.92,109.55 J10.3 | D1.K 99.18,58.75 100.45,60.02 100.45,83.9 98.03,86.31 96.51,86.31 94.73,88.09 94.73,107.77 93.08,109.43 91.69,109.43 J10.3 | J10.3 91.69,110.19 91.69,114.51 GND.3 92.32,113.11 119.62,113.11 124.2,108.54 128.64,108.54 C1.2
  Bottom 1.5: C1.2 128.77,108.41 128.77,96.47 133.59,91.65 133.59,89.61 135.63,87.58 S1.P$6 136.39,87.58 138.17,87.58 S1.P$3 | BATT4.N1 19.04,54.82 32.25,54.82 34.79,57.36 97.02,57.36 98.42,58.75 D1.K
BTN1
  Top 0.254: U$4.PG0 92.19,66.63 88,66.63 J4.4 87.88,66.63 64.38,66.63 50.41,80.6 48.5,80.6 38.34,70.44 38.34,51.89 33.01,46.56 31.36,46.56 25.39,40.59 25.39,12.14 23.99,10.75 B1.S2 23.99,10.62 12.06,10.62 B1.S
BTN2  (via drill 0.38)
  Top 0.254: J4.3 88,69.17 92.19,69.17 U$4.PG1 92.32,69.04 97.27,64.09 97.27,58.24 107.56,47.96 v111.24,47.96 | B2.S 120.01,10.62 131.94,10.62 B2.S2
  Bottom 0.254: v111.24,47.96 118.61,40.59 118.61,11.89 119.88,10.62 B2.S
D3
  Top 0.254: J7.1 46.98,109.55 46.98,114.51 J6.1
  Bottom 0.254: U$4.J2.D3 97.27,74.12 97.27,74.75 84.32,87.71 84.32,100.41 82.67,102.06 56.25,102.06 50.03,108.28 48.25,108.28 47.11,109.43 J7.1
D4  (via drill 0.38)
  Top 0.254: J7.2 49.52,109.55 49.52,114.51 J6.2 | v72.38,116.03 72.38,110.95 76.83,106.5 88.64,106.5 93.59,101.55 93.59,80.98 97.27,77.29 97.27,76.66 U$4.PE4
  Bottom 0.254: v72.38,116.03 71.24,117.17 51.43,117.17 49.65,115.39 49.65,114.63 J6.2
D5
  Top 0.254: J7.3 52.06,109.55 52.06,114.51 J6.3
  Bottom 0.254: U$4.J2.D5 97.27,79.2 93.59,79.2 84.83,87.96 84.83,100.66 82.92,102.57 56.51,102.57 52.19,106.89 52.19,109.43 J7.3
D9
  Top 0.254: J7.4 54.6,109.55 54.6,114.51 J6.4
  Bottom 0.254: U$4.J2.D9 97.27,90.88 97.27,91.52 93.59,95.2 93.59,101.55 86.86,108.28 84.06,108.28 80.51,111.84 56.51,111.84 54.73,113.62 54.73,114.51 J6.4
D18
  Top 0.254: U$4.PG2 92.19,71.71 88,71.71 J4.2 87.88,71.71 63.36,71.71 57.27,77.8 57.27,109.43 J7.5 57.14,109.55 57.14,114.51 J6.5
D19
  Top 0.254: U$4.PG5 92.19,74.25 88,74.25 J4.1 88,74.37 88,91.65 84.32,95.33 84.32,100.41 80.13,104.6 64.63,104.6 59.81,109.43 J7.6 59.68,109.55 59.68,114.51 J6.6
GND
  Top 0.254: TM2.1 46.47,49.1 47.23,49.1 48.5,47.83 91.18,47.83 92.45,49.1 TM1.1 | 136.26,39.07 136.9,39.07 137.41,38.56 J14.1 | 136.26,39.07 124.58,39.07 J13.3 | 136.26,39.07 136.26,56.47 137.41,57.61 137.41,57.99 J1.6 | U$3.P$10 82.8,77.04 80.38,77.04 U$3.P$9 80.25,77.04 77.84,77.04 U$3.P$8 77.72,77.04 75.3,77.04 U$3.P$7 75.17,77.04 72.76,77.04 U$3.P$6 72.64,77.04 70.22,77.04 U$3.P$5 70.09,77.04 67.68,77.04 U$3.P$4 67.56,77.04 65.14,77.04 U$3.P$3 65.02,77.04 62.6,77.04 U$3.P$2 62.48,77.04 60.06,77.04 U$3.P$1 | LED1.K 138.68,106.12 138.42,106.12 137.28,107.27 101.08,107.27 97.4,103.58 U$4.GND2 | F1.A 17.9,43 17.9,40.72 17.26,40.08 17.26,36.4 19.17,34.5 19.93,34.5 J15.3 | J2.3 5.96,50.12 5.96,50.37 4.82,51.51 4.82,54.82 5.96,55.96 J2.6 5.96,56.09 5.96,56.34 3.17,59.13 3.17,88.47 R5.1 | D3.K 6.85,106.63 12.06,106.63 12.44,107.01 RESET.S 12.18,106.63 12.18,105.49 17.14,100.54 R4.1 17.26,100.54 23.74,107.01 24.38,107.01 RESET.S2 | U$4.GND 49.14,89.36 49.14,89.99 50.92,91.77 50.92,102.82 42.79,110.95 36.82,110.95 C2.2
  Bottom 0.254: J1.6 137.53,58.12 137.53,58.37 138.8,59.64 138.8,62.69 137.53,63.96 J1.3 | 137.53,29.16 137.53,32.84 138.8,34.11 138.8,37.16 137.53,38.43 J14.1 | 137.53,29.16 137.53,28.53 J12.1 137.53,29.16 | 137.53,29.16 124.58,29.16 J11.3 | TM1.1 92.57,49.1 93.21,49.1 94.48,47.83 109.97,47.83 110.99,48.85 114.8,48.85 124.45,39.19 J13.3 | U$3.P$1 59.94,77.04 58.79,77.04 49.14,86.69 U$4.GND1 | 7.17,25.92 7.23,25.99 7.23,33.35 6.09,34.5 J16.1 5.96,34.62 4.82,35.77 4.82,44.78 | 7.17,25.92 6.09,24.84 6.09,24.59 J18.1 | 17.26,23.95 9.13,23.95 7.17,25.92 | 17.26,23.95 19.93,23.95 J17.3 | 4.82,44.78 4.82,48.59 5.96,49.74 5.96,49.99 J2.3 | 17.26,23.95 17.26,29.54 19.93,32.21 19.93,34.37 J15.3 | C2.2 36.69,110.95 36.31,110.95 32.5,107.14 24.5,107.14 RESET.S2 | R5.1 3.17,88.6 5.33,88.6 17.14,100.41 R4.1 | 4.82,44.78 6.98,44.78 11.29,49.1 46.35,49.1 TM2.1
LED_BLUE
  Top 0.254: D3.A 4.31,106.63 4.56,106.63 15.1,117.17 60.32,117.17 63.87,113.62 63.87,108.92 67.68,105.11 81.27,105.11 87.88,98.5 J5.2 88.13,98.5 92.19,98.5 U$4.PD6
LED_GREEN  (via drill 0.38)
  Top 0.254: v33.52,97.74 9.26,97.74 5.07,93.55 4.31,93.55 D5.A | v78.98,103.46 v76.7,101.17
  Bottom 0.254: v33.52,97.74 42.79,97.74 48.5,103.46 54.09,103.46 56.25,101.3 76.57,101.3 v76.7,101.17 | v78.98,103.46 82.8,103.46 85.72,100.54 85.72,87.84 91.69,81.87 92.83,81.87 93.59,82.63 93.59,94.44 92.19,95.84 U$4.PD5 92.07,95.84 88,95.84 J5.3
LED_RED
  Bottom 0.254: D4.A 4.31,100.03 4.94,100.03 8.75,103.84 32.63,103.84 40.12,111.33 78.48,111.33 79.87,109.93 79.87,107.9 86.73,101.04 86.73,94.57 87.88,93.42 J5.4 88.13,93.42 92.19,93.42 U$4.PD4
N$1
  Top 1.5: BATT1.N2 124.96,46.69 124.96,54.18 BATT1.N1 124.7,54.94 124.7,77.29 109.34,92.66 BATT2.P2 108.96,93.3 108.96,100.79 BATT2.P1
N$2
  Top 1.5: BATT3.P2 35.04,93.8 35.04,101.3 BATT3.P1 | BATT2.N2 108.96,52.15 108.96,59.64 BATT2.N1
  Bottom 1.5: BATT3.P2 35.04,93.68 36.82,93.68 49.39,81.1 53.08,81.1 70.48,63.71 105.02,63.71 108.96,59.77 BATT2.N1
N$3
  Top 1.5: BATT3.N2 35.04,52.66 35.04,60.15 BATT3.N1 34.66,60.91 34.66,72.47 19.42,87.71 BATT4.P2 19.04,88.34 19.04,95.84 BATT4.P1
N$4
  Top 0.254: R4.2 24.76,100.41 18.53,100.41 17.64,99.52 7.23,99.52 6.85,99.9 D4.K
N$5
  Top 1.5: S1.P$1 138.17,95.58 135.75,95.58 S1.P$4 135.12,95.46 125.09,95.46 BATT1.P1 124.96,94.69 124.96,87.84 BATT1.P2
N$6
  Top 0.254: R5.2 10.79,88.6 10.79,89.49 6.85,93.42 D5.K
N$9
  Top 0.254: J5.1 88,101.04 92.19,101.04 U$4.PD7
N$13
  Bottom 0.254: D2.K 45.58,59.26 96.38,59.26 98.42,61.29 D1.A
PITCH
  Top 0.254: J12.3 137.41,24.59 127.25,24.59 125.34,26.49 124.58,26.49 J11.2
  Bottom 0.254: 137.53,65.74 137.53,65.99 J1.2 137.53,65.74 | 137.53,65.74 139.31,63.96 139.31,26.37 137.53,24.59 J12.3 | 137.53,65.74 129.66,57.86 106.8,57.86 102.1,62.56 69.97,62.56 61.08,71.45 49.14,71.45 U$4.A3
POT1
  Top 0.254: TM1.2 94.99,49.23 94.22,49.23 78.1,65.36 50.54,65.36 49.14,63.96 U$4.A6
POT2
  Top 0.254: TM2.2 49.01,49.23 49.01,61.29 51.55,63.83 U$4.A7
RESET
  Top 0.254: U$4.RESET 49.01,96.98 43.42,96.98 28.44,111.97 24.5,111.97 RESET.P2 24.38,112.09 12.56,112.09 RESET.P
ROLL
  Top 0.254: U$4.A2 49.14,73.99 56.25,73.99 64.38,65.86 86.99,65.86 105.78,47.07 113.28,47.07 123.69,36.65 124.45,36.65 J13.2
  Bottom 0.254: 136.26,34.62 127.25,34.62 125.34,36.53 124.58,36.53 J13.2 | 136.26,34.62 137.41,34.62 J14.3 | 136.26,34.62 136.26,58.5 137.41,59.64 137.41,60.02 J1.5
THROTTLE
  Top 0.254: J16.3 5.96,38.56 5.96,43.26 4.82,44.4 4.82,47.07 5.71,47.96 5.96,47.96 J2.2
  Bottom 0.254: U$4.A1 49.01,76.66 34.66,76.66 6.09,48.08 J2.2 | J15.2 19.93,37.04 7.48,37.04 6.09,38.43 J16.3
TX1
  Bottom 0.254: J3.BLUE 4.56,79.58 4.56,79.83 18.79,94.06 23.61,94.06 40.38,110.82 76.95,110.82 77.33,110.44 77.33,108.92 82.29,103.96 83.05,103.96 86.22,100.79 86.22,93.42 88.76,90.88 92.19,90.88 U$4.TX1
VBAT  (via drill 0.38)
  Top 1.5: v41.77,75.52 41.77,76.91 49.01,84.15 U$4.VCC 49.65,84.66 49.9,84.91 50.03,84.91 56.12,91.01 v56.12,104.6 | 77.33,109.55 78.48,109.55 J9.2 79.24,109.55 81.02,109.55 J9.3 81.78,109.3 83.56,109.3 85.21,107.65 v92.32,107.65 | 77.33,109.55 76.06,109.55 J9.1 | 77.33,114.51 78.48,114.51 VBAT.2 79.24,114.51 81.02,114.51 VBAT.3 | 77.33,114.51 76.06,114.51 VBAT.1 | 77.33,114.51 77.33,109.55
  Bottom 1.5: J3.RED 6.59,79.58 6.59,80.22 12.18,85.8 22.09,85.8 32.5,96.22 37.46,96.22 46.98,86.69 46.98,86.06 48.76,84.28 49.01,84.28 U$4.VCC | v41.77,75.52 45.46,71.83 45.46,61.8 D2.A | S1.P$2 138.17,91.52 136.39,91.52 S1.P$5 135.63,91.65 135.63,92.15 133.59,94.19 133.59,106.25 129.53,110.31 128.01,110.31 126.23,108.54 121.28,108.54 C1.1 120.64,108.92 116.45,113.11 96.38,113.11 95.24,111.97 95.24,110.57 v92.32,107.65 | v56.12,104.6 61.46,104.6 61.84,104.22 70.73,104.22 75.94,109.43 J9.1
YAW
  Top 0.254: 7.74,28.4 17.26,28.4 19.17,26.49 19.93,26.49 J17.2 | 7.74,28.4 6.09,28.4 J18.3 | 7.74,28.4 7.74,52.02 6.09,53.67 6.09,53.93 J2.5
  Bottom 0.254: U$4.A0 49.01,79.07 31.11,79.07 6.09,54.05 J2.5

### Text on the board
tPlace: THR | ROLL | YAW | PITCH
Measures: Remote Mark II | Steven Swanson